# EAGLE schematic メイン回路 Issaimaru側 (EAGLE 9.6.2)
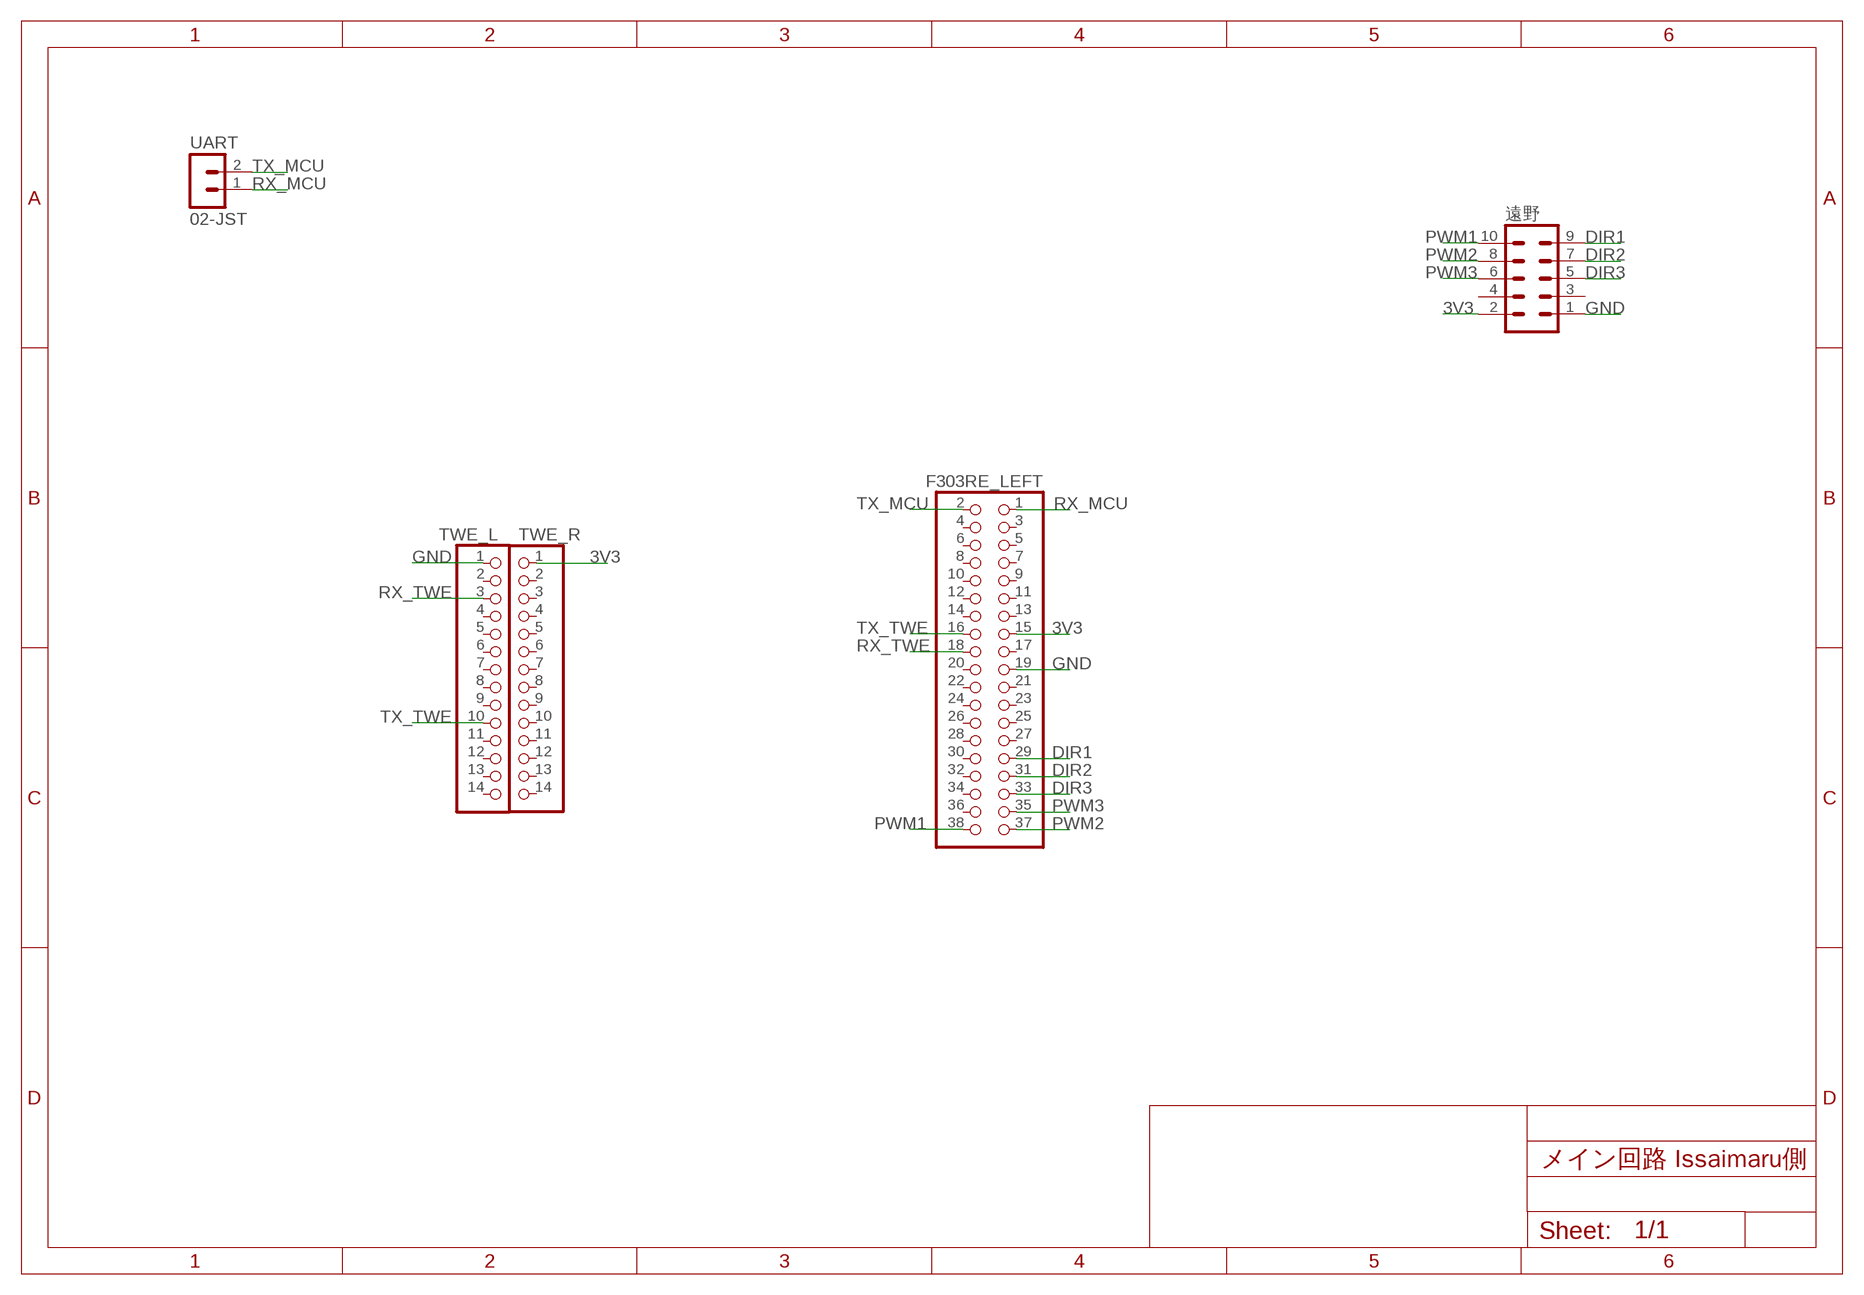
[diagram p0: schematic, sheet 1]

## Parts
F303RE_LEFT  PINHD-2X19  [2X19]
TWE_L  PINHD-1X14  [1X14]
TWE_R  PINHD-1X14  [1X14]
UART  02-JST  [B2B-XH]
遠野  ML10  [ML10]

## Nets
3V3: F303RE_LEFT.15 TWE_R.1 遠野.2
DIR1: F303RE_LEFT.29 遠野.9
DIR2: F303RE_LEFT.31 遠野.7
DIR3: F303RE_LEFT.33 遠野.5
GND: F303RE_LEFT.19 TWE_L.1 遠野.1
PWM1: F303RE_LEFT.38 遠野.10
PWM2: F303RE_LEFT.37 遠野.8
PWM3: F303RE_LEFT.35 遠野.6
RX_MCU: F303RE_LEFT.1 UART.1
RX_TWE: F303RE_LEFT.18 TWE_L.3
TX_MCU: F303RE_LEFT.2 UART.2
TX_TWE: F303RE_LEFT.16 TWE_L.10
Unconnected: F303RE_LEFT.3 F303RE_LEFT.4 F303RE_LEFT.5 F303RE_LEFT.6 F303RE_LEFT.7 F303RE_LEFT.8 F303RE_LEFT.9 F303RE_LEFT.10 F303RE_LEFT.11 F303RE_LEFT.12 F303RE_LEFT.13 F303RE_LEFT.14 F303RE_LEFT.17 F303RE_LEFT.20 F303RE_LEFT.21 F303RE_LEFT.22 F303RE_LEFT.23 F303RE_LEFT.24 F303RE_LEFT.25 F303RE_LEFT.26 F303RE_LEFT.27 F303RE_LEFT.28 F303RE_LEFT.30 F303RE_LEFT.32 F303RE_LEFT.34 F303RE_LEFT.36 TWE_L.2 TWE_L.4 TWE_L.5 TWE_L.6 TWE_L.7 TWE_L.8 TWE_L.9 TWE_L.11 TWE_L.12 TWE_L.13 TWE_L.14 TWE_R.2 TWE_R.3 TWE_R.4 TWE_R.5 TWE_R.6 TWE_R.7 TWE_R.8 TWE_R.9 TWE_R.10 TWE_R.11 TWE_R.12 TWE_R.13 TWE_R.14 遠野.3 遠野.4

## Library data of the parts
F303RE_LEFT = pinhead:PINHD-2X19: PIN HEADER
TWE_L TWE_R = pinhead:PINHD-1X14: PIN HEADER
UART = con-jst-xh:02-JST: JST CONNECTOR
遠野 = con-ml:ML10: HARTING; OC_FARNELL: unknown; OC_NEWARK: unknown